# Altium schematic sheet SD_Card.SchDoc
size A
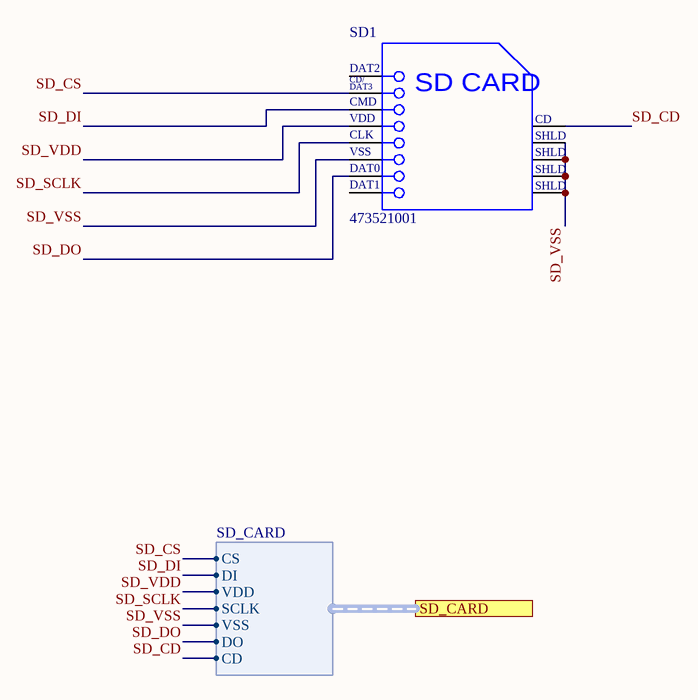
[diagram p0: SD_Card.SchDoc]

## Parts
SD1  473521001  [MOLX-473521001_V]

## Ports
SD_CARD (harness SD_CARD)

## Harnesses
SD_CARD: CS, DI, VDD, SCLK, VSS, DO, CD

## Nets
SD_CD: SD1.9(CD) ; port SD_CARD.CD
SD_CS: SD1.2(CD/DAT3) ; port SD_CARD.CS
SD_DI: SD1.3(CMD) ; port SD_CARD.DI
SD_DO: SD1.7(DAT0) ; port SD_CARD.DO
SD_SCLK: SD1.5(CLK) ; port SD_CARD.SCLK
SD_VDD: SD1.4(VDD) ; port SD_CARD.VDD
SD_VSS: SD1.6(VSS) SD1.10(SHLD) SD1.11(SHLD) SD1.12(SHLD) SD1.13(SHLD) ; port SD_CARD.VSS

Not connected (* = marked no-connect by the designer): SD1 1(DAT2) 8(DAT1)

## Notes on the sheet
- (in symbol CMP-2000-05848-1) CD/; DAT3; SD CARD

## Library data of the parts
SD1 = CMP-2000-05848-1: MicroSD(TM), Pitch 1.1 mm, 8 Position, Height 1.88 mm, -20 to 85 degC, RoHS, Tape and Reel; Manufacturer: Molex; Datasheet Version: Rev. G, 01/2012; Datasheet URL: http://www.molex.com/pdm_docs/sd/473521001_sd.pdf; Package Reference: 473521001; Manufacturer URL: http://www.molex.com/; Mounting Technology: SurfaceMount; Package Description: MicroSD(TM), Pitch 1.1 mm, 8 Position, Height 1.88 mm; Supplier Unit Price 1: 3.58000; Supplier 1: Digi-Key; Supplier Part Number 1: WM3290CT-ND